# Altium schematic sheet stm32F7_144.SchDoc
size A4; SheetNumber: 1; SheetTotal: 6
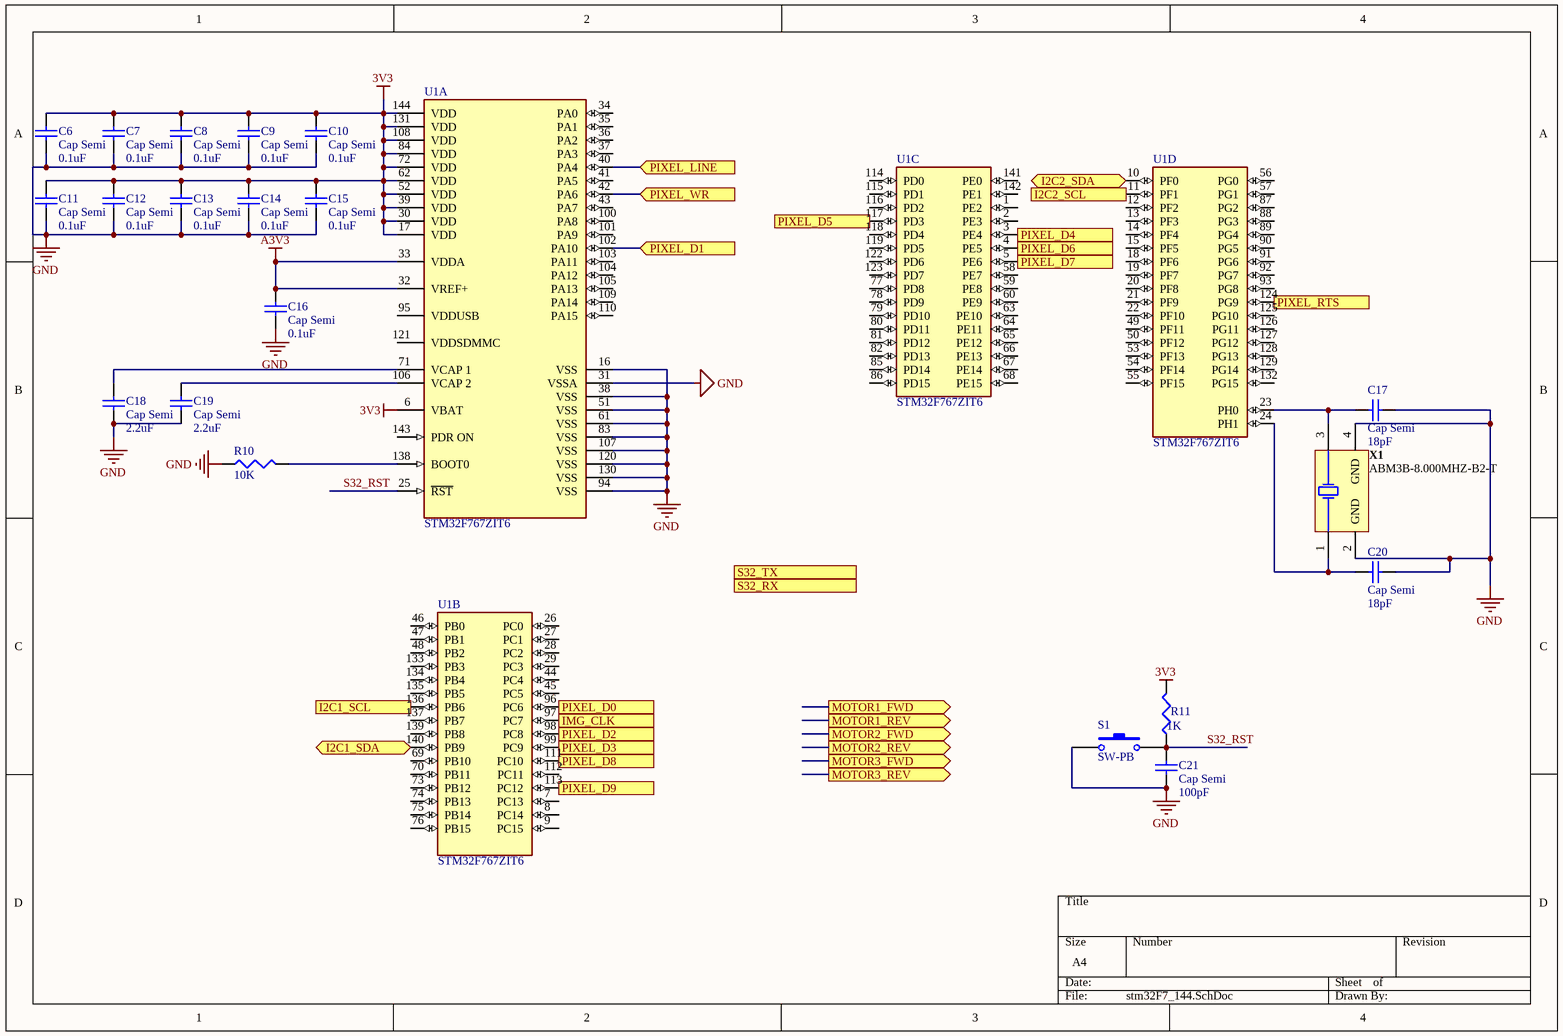
[diagram p0: stm32F7_144.SchDoc]

## Parts
C6  Cap Semi  value 0.1uF  [C1206]
C7  Cap Semi  value 0.1uF  [C1206]
C8  Cap Semi  value 0.1uF  [C1206]
C9  Cap Semi  value 0.1uF  [C1206]
C10  Cap Semi  value 0.1uF  [C1206]
C11  Cap Semi  value 0.1uF  [C1206]
C12  Cap Semi  value 0.1uF  [C1206]
C13  Cap Semi  value 0.1uF  [C1206]
C14  Cap Semi  value 0.1uF  [C1206]
C15  Cap Semi  value 0.1uF  [C1206]
C16  Cap Semi  value 0.1uF  [C1206]
C17  Cap Semi  value 18pF  [C1206]
C18  Cap Semi  value 2.2uF  [C1206]
C19  Cap Semi  value 2.2uF  [C1206]
C20  Cap Semi  value 18pF  [C1206]
C21  Cap Semi  value 100pF  [C1206]
R10  value 10K  [J1-0603]  (hidden comment: Res3)
R11  value 1K  [J1-0603]  (hidden comment: Res3)
S1  SW-PB  [SPST-2]
U1  STM32F767ZIT6  [FP-LQFP144-1A-MFG]  (parts A,B,C,D of 4)
X1  ABM3B-8.000MHZ-B2-T  [ABRA-ABM3B_V]

## Ports
I2C1_SCL (out), I2C1_SDA (bidir), I2C2_SCL (out), I2C2_SDA (bidir), IMG_CLK (out), MOTOR1_FWD (out), MOTOR1_REV (out), MOTOR2_FWD (out), MOTOR2_REV (out), MOTOR3_FWD (out), MOTOR3_REV (out), PIXEL_D0 (in), PIXEL_D1 (in), PIXEL_D2 (in), PIXEL_D3 (in), PIXEL_D4 (in), PIXEL_D5 (in), PIXEL_D6 (in), PIXEL_D7 (in), PIXEL_D8 (in), PIXEL_D9 (in), PIXEL_LINE (in), PIXEL_RTS (in), PIXEL_WR (in), S32_RX (in), S32_TX (out)

## Nets
3V3: C6.2 C7.2 C8.2 C9.2 C10.2 C11.2 C12.2 C13.2 C14.2 C15.2 U1.6(VBAT) U1.17(VDD) U1.30(VDD) U1.39(VDD) U1.52(VDD) U1.62(VDD) U1.72(VDD) U1.84(VDD) U1.108(VDD) U1.131(VDD) U1.144(VDD)
A3V3: C16.2 U1.32(VREF+) U1.33(VDDA)
GND: C6.1 C7.1 C8.1 C9.1 C10.1 C11.1 C12.1 C13.1 C14.1 C15.1 C16.1 C17.2 C18.1 C19.1 C20.2 C21.1 R10.1 S1.1 U1.16(VSS) U1.31(VSSA) U1.38(VSS) U1.51(VSS) U1.61(VSS) U1.83(VSS) U1.94(VSS) U1.107(VSS) U1.120(VSS) U1.130(VSS) X1.2(GND) X1.4(GND)
I2C1_SCL: U1.136(PB6) ; port I2C1_SCL
I2C1_SDA: U1.140(PB9) ; port I2C1_SDA
I2C2_SCL: U1.11(PF1) ; port I2C2_SCL
I2C2_SDA: U1.10(PF0) ; port I2C2_SDA
IMG_CLK: U1.97(PC7) ; port IMG_CLK
PIXEL_D0: U1.96(PC6) ; port PIXEL_D0
PIXEL_D1: U1.102(PA10) ; port PIXEL_D1
PIXEL_D2: U1.98(PC8) ; port PIXEL_D2
PIXEL_D3: U1.99(PC9) ; port PIXEL_D3
PIXEL_D4: U1.3(PE4) ; port PIXEL_D4
PIXEL_D5: U1.117(PD3) ; port PIXEL_D5
PIXEL_D6: U1.4(PE5) ; port PIXEL_D6
PIXEL_D7: U1.5(PE6) ; port PIXEL_D7
PIXEL_D8: U1.111(PC10) ; port PIXEL_D8
PIXEL_D9: U1.113(PC12) ; port PIXEL_D9
PIXEL_LINE: U1.40(PA4) ; port PIXEL_LINE
PIXEL_RTS: U1.124(PG9) ; port PIXEL_RTS
PIXEL_WR: U1.42(PA6) ; port PIXEL_WR
S32_RST: C21.2 R11.1 S1.2 U1.25(~{RST})
NetC17_1: C17.1 U1.23(PH0) X1.3(X2)
NetC18_2: C18.2 U1.71(VCAP_1)
NetC19_2: C19.2 U1.106(VCAP_2)
NetC20_1: C20.1 U1.24(PH1) X1.1(X1)
NetR10_2: R10.2 U1.138(BOOT0)

Not connected (* = marked no-connect by the designer): R11 2; U1 1(PE2) 2(PE3) 7(PC13) 8(PC14) 9(PC15) 12(PF2) 13(PF3) 14(PF4) 15(PF5) 18(PF6) 19(PF7) 20(PF8) 21(PF9) 22(PF10) 26(PC0) 27(PC1) 28(PC2) 29(PC3) 34(PA0) 35(PA1) 36(PA2) 37(PA3) 41(PA5) 43(PA7) 44(PC4) 45(PC5) 46(PB0) 47(PB1) 48(PB2) 49(PF11) 50(PF12) 53(PF13) 54(PF14) 55(PF15) 56(PG0) 57(PG1) 58(PE7) 59(PE8) 60(PE9) 63(PE10) 64(PE11) 65(PE12) 66(PE13) 67(PE14) 68(PE15) 69(PB10) 70(PB11) 73(PB12) 74(PB13) 75(PB14) 76(PB15) 77(PD8) 78(PD9) 79(PD10) 80(PD11) 81(PD12) 82(PD13) 85(PD14) 86(PD15) 87(PG2) 88(PG3) 89(PG4) 90(PG5) 91(PG6) 92(PG7) 93(PG8) 95(VDDUSB) 100(PA8) 101(PA9) 103(PA11) 104(PA12) 105(PA13) 109(PA14) 110(PA15) 112(PC11) 114(PD0) 115(PD1) 116(PD2) 118(PD4) 119(PD5) 121(VDDSDMMC) 122(PD6) 123(PD7) 125(PG10) 126(PG11) 127(PG12) 128(PG13) 129(PG14) 132(PG15) 133(PB3) 134(PB4) 135(PB5) 137(PB7) 139(PB8) 141(PE0) 142(PE1) 143(PDR_ON)

## Notes on the sheet
- Labels drawn without touching a wire or pin: 3V3

## Library data of the parts
C6-C21 = Cap Semi: Capacitor (Semiconductor SIM Model); Published: 8-Jun-2000; LatestRevisionDate: 29-May-2009; LatestRevisionNote: IPC-7351 Footprint Added.; PackageReference: C1206; Publisher: Altium Limited; PackageDescription: Chip Capacitor
R10 R11 = Res3: Resistor; Published: 8-Jun-2000; LatestRevisionDate: 29-May-2009; LatestRevisionNote: IPC-7351 Footprint Added.; PackageReference: J1-0603; Publisher: Altium Limited; PackageDescription: Chip Resistor
S1 = SW-PB: Switch; Published: 24-Mar-1999; LatestRevisionDate: 17-Jul-2002; LatestRevisionNote: Re-released for DXP Platform.; PackageReference: SPST-2; Publisher: Altium Limited; PackageDescription: Switch; 2 Leads
U1 = CMP-12105-000074-1: IC MCU 32BIT 2MB FLASH 144LQFP; Manufacturer: STMicroelectronics; Ram Size: 512KBytes; Number Of I/Os: 114; Core Architecture: ARM Cortex-M7; Memory Size: 2048KBytes; Standoff Height: 0.05mm; Number Of Adc Channels: 24; Max Supply Voltage: 3.6V; Number Of Pwm Channels: 4; Min Supply Voltage: 1.7V; Max Junction Temp: +105°C; Number Of Timers/Counters: 15; Number Of Usb Channels: 1; Interface: I2C,SPI,UART,USART,EBI/EMI,CAN,USB,LIN,IrDA,Ethernet,I2S; Frequency: 216MHz; Data Bus Width: 32bits; Number Of Spi Channels: 6; Number Of A/D Converters: 3; Octopart: https://octopart.com/stm32f767zit6-stmicroelectronics-70527068; Category: IC; Device Class L2: Embedded Processors and Controllers; Package: LQFP144-1A; RoHS: TRUE; Digikey Description: IC MCU 32BIT 2MB FLASH 144LQFP; ComponentLink2Description: Datasheet; Automotive: No; Mouser Description: ARM Microcontrollers - MCU High-performance and DSP with FPU, ARM Cortex-M7 MCU with 2 Mbytes Flash, 216 MHz CPU, Art Accelerator, L1 cache, SDRAM,; Ambient Temperature Range Low: -40°C; Ambient Temperature Range High: +85°C; Memory Type: FLASH; ComponentLink2URL: https://www.st.com/resource/en/datasheet/stm32f767zi.pdf; Number Of Uart Channels: 4; Temperature: -40°C to +85°C; Device Class L3: Microcontrollers; Device Class L1: Integrated Circuits (ICs); Temperature Range Low: -40°C; Temperature Range High: +85°C; Lead Free: Yes; Number Of I2C Channels: 4; Number Of Ethernet Channels: 1; Height: 1.6mm; Number Of Cores: 1; Manufacturer Part Number: STM32F767ZIT6; Ipc Land Pattern Name: QFP50P2200X2200X160-144
X1 = CMP-1688-00002-1: Ceramic SMD Crystal, 8 MHz, +/- 20 ppm, 200 Ohm, -20 to 70 degC, 4-Pin SMD, RoHS, Tape and Reel; Max Supply Voltage: 45 V; Outputs: 4; Min Supply Voltage: 8.2 V; Output Voltage: 3.3 V; Switching Frequency: 30 KHz; Output Current: 1.8 A; Packaging: Rail/Tube; ComponentLink2Description: Datasheet; REACH SVHC: No SVHC; ComponentLink1URL: http://www.abracon.com/; PackageReference: ABM3B; Weight: 0.004233 oz; Height: 1.05 mm; ComponentLink2URL: http://www.abracon.com/Resonators/abm3b.pdf; Mount: Surface Mount; Min Operating Temperature: -40 degC; Max Operating Temperature: 85 degC; Package Quantity: 50; PackageDescription: 4-Pin Surface Mount Device, Body 5 x 3.2 mm; Pins: 28; DatasheetVersion: Aug-15; ComponentLink1Description: Manufacturer URL; RoHSCompliant: true; Radiation Hardening: No; Length: 9.8 mm; Width: 4.5 mm